# EAGLE design usb-current-meter (EAGLE 6.3)
Assembly variants: rectifier, bias
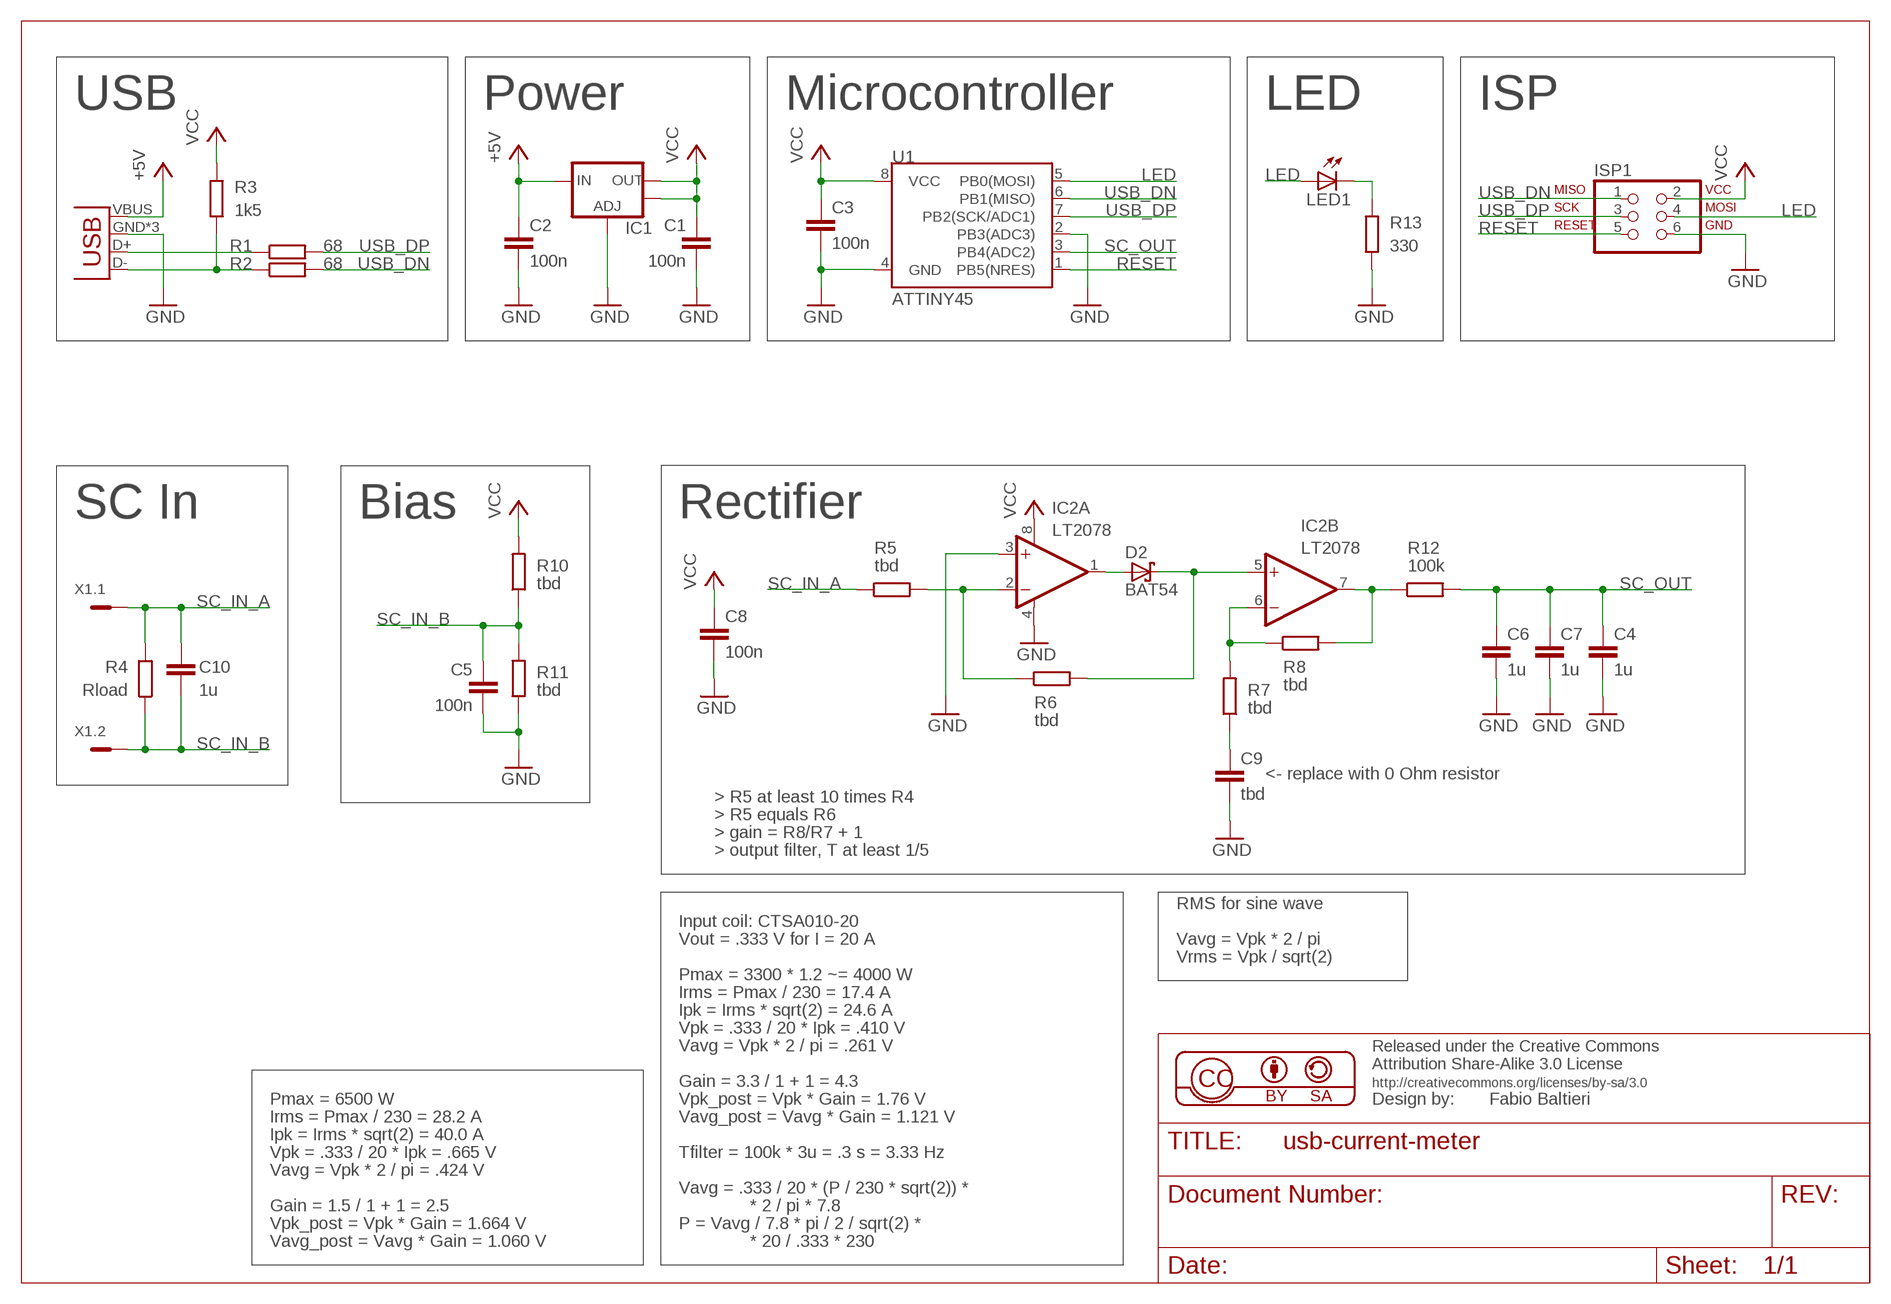
[diagram p0: schematic, sheet 1]

## Parts
C1  100n  C-EUC0805  [C0805]
C2  100n  C-EUC0805  [C0805]
C3  100n  C-EUC0805  [C0805]
C4  1u  C-EUC0805  [C0805]  (not fitted in variant bias)
C5  100n  C-EUC0805  [C0805]  (not fitted in variant rectifier)
C6  1u  C-EUC0805  [C0805]  (not fitted in variant bias)
C7  1u  C-EUC0805  [C0805]  (not fitted in variant bias)
C8  100n  C-EUC0805  [C0805]
C9  tbd  C-EUC0805  [C0805]  (variant rectifier: 0)
C10  1u  C-EUC0805  [C0805]
D2  BAT54  [SOT23]  (not fitted in variant bias)
IC1  V_REG_LM1117SOT223  [SOT223]
IC2  LT2078  OPA2234U  [SO08]  (not fitted in variant bias)
ISP1  ISP-AVR910  [2X03_BORDER_TP]
LED1  LEDSML0805  [SML0805]
R1  68  R-EU_R0603  [R0603]
R2  68  R-EU_R0603  [R0603]
R3  1k5  R-EU_R0603  [R0603]
R4  Rload  R-EU_R0805  [R0805]  (not fitted in variant rectifier)  (not fitted in variant bias)
R5  tbd  R-EU_R0603  [R0603]  (variant bias: 0)  (variant rectifier: 10k)
R6  tbd  R-EU_R0603  [R0603]  (variant bias: 0)  (variant rectifier: 10k)
R7  tbd  R-EU_R0603  [R0603]  (not fitted in variant bias)  (variant rectifier: 1k)
R8  tbd  R-EU_R0603  [R0603]  (not fitted in variant bias)  (variant rectifier: 3.3k)
R10  tbd  R-EU_R0603  [R0603]  (not fitted in variant rectifier)
R11  tbd  R-EU_R0603  [R0603]  (variant rectifier: 0)
R12  100k  R-EU_R0603  [R0603]  (variant bias: 0)
R13  330  R-EU_R0603  [R0603]
U1  ATTINY45  [SO08-EIAJ]
X1  MC2  [MC2]
X3  USB-A-H  [USB-A-H]

## Nets
+5V: C2.1 IC1.3(IN) X3.VBUS(GND)
GND: C1.2 C2.2 C3.2 C4.2 C5.2 C6.2 C7.2 C8.2 C9.2 IC1.1(ADJ) IC2.3(A:+IN) IC2.4(A:V-) ISP1.6 R11.1 R13.1 U1.2(PB3(ADC3)) U1.4(GND) X3.GND2(VBUS) X3.GND3(VBUS) X3.GND(VBUS)
LED: ISP1.4 LED1.A U1.5(PB0(MOSI))
N$1: R2.1 R3.1 X3.D-(D+)
N$2: R1.1 X3.D+(D-)
N$3: LED1.C R13.2
N$4: C9.1 R7.1
N$7: IC2.2(A:-IN) R5.2 R6.1
N$8: D2.1(A) IC2.1(A:OUT)
N$9: D2.3(C) IC2.5(B:+IN) R6.2
N$11: IC2.6(B:-IN) R7.2 R8.1
N$12: IC2.7(B:OUT) R8.2 R12.1
RESET: ISP1.5 U1.1(PB5(NRES))
SC_IN_A: C10.1 R4.2 R5.1 X1.1
SC_IN_B: C5.1 C10.2 R4.1 R10.1 R11.2 X1.2
SC_OUT: C4.1 C6.1 C7.1 R12.2 U1.3(PB4(ADC2))
USB_DN: ISP1.1 R2.2 U1.6(PB1(MISO))
USB_DP: ISP1.3 R1.2 U1.7(PB2(SCK/ADC1))
VCC: C1.1 C3.1 C8.1 IC1.2(OUT) IC1.4(OUT) IC2.8(A:V+) ISP1.2 R3.2 R10.2 U1.8(VCC)

## Notes on the sheet
- USB | Power | Microcontroller | LED | ISP
- SC In | Bias | Rectifier
- <- replace with 0 Ohm resistor
- > R5 at least 10 times R4
- > R5 equals R6
- > gain = R8/R7 + 1
- > output filter, T at least 1/5
- RMS for sine wave
- Input coil: CTSA010-20
- Vout = .333 V for I = 20 A | Vavg = Vpk * 2 / pi
- Vrms = Vpk / sqrt(2)
- Pmax = 3300 * 1.2 ~= 4000 W
- Irms = Pmax / 230 = 17.4 A
- Ipk = Irms * sqrt(2) = 24.6 A
- Vpk = .333 / 20 * Ipk = .410 V
- Vavg = Vpk * 2 / pi = .261 V
- Gain = 3.3 / 1 + 1 = 4.3
- Pmax = 6500 W | Vpk_post = Vpk * Gain = 1.76 V
- Irms = Pmax / 230 = 28.2 A | Vavg_post = Vavg * Gain = 1.121 V
- Ipk = Irms * sqrt(2) = 40.0 A
- Vpk = .333 / 20 * Ipk = .665 V | Tfilter = 100k * 3u = .3 s = 3.33 Hz
- Vavg = Vpk * 2 / pi = .424 V
- Vavg = .333 / 20 * (P / 230 * sqrt(2)) *
- Gain = 1.5 / 1 + 1 = 2.5 | * 2 / pi * 7.8
- Vpk_post = Vpk * Gain = 1.664 V | P = Vavg / 7.8 * pi / 2 / sqrt(2) *
- Vavg_post = Vavg * Gain = 1.060 V | * 20 / .333 * 230

## Library data of the parts
C1-C10 = rcl:C-EU: CAPACITOR, European symbol
D2 = diode:BAT54: Schottky Diodes Source: Fairchild .. BAT54.pdf
IC1 = SparkFun:V_REG_LM1117: Voltage Regulator LM1117 Standard adjustable voltage regulator but in SMD form. Spark Fun Electronics SKU : COM-00595
IC2 = burr-brown:OPA2234: Operational Amplifier; MF: TEXAS INSTRUMENTS; MPN: OPA2234U; OC_FARNELL: 1212441; OC_NEWARK: 96K4523
ISP1 = balto:ISP-AVR910: PIN HEADER
LED1 = led:LED: LED OSRAM: - CHIPLED LG R971, LG N971, LY N971, LG Q971, LY Q971, LO R971, LY R971 LH N974, LH R974 LS Q976, LO Q976, LY Q976 LO Q996 - Hyper CHIPLED LW Q18S LB Q993, LB Q99A, LB R99A - SideLED LS A670, LO A670, LY A670, LG A670, LP A670 LB A673, LV A673, LT A673, LW A673 LH A674 LY A675 LS A676, LA A676, LO A676, LY A676, LW A676 LS A679, LY A679, LG A679 - Hyper Micro SIDELED® LS Y876, LA Y876, LO Y876, LY Y876 LT Y87S - SmartLED LW L88C, LW L88S LB L89C, LB L89S, LG L890 LS L89K, LO L89K, LY L89K LS L896, LA L896, LO L896, LY L896 - TOPLED LS T670, LO T670, LY T670, LG T670, LP T670 LSG T670, LSP T670, LSY T670, LOP T670, LYG T670 LG T671, LOG T671, LSG T671 LB T673, LV T673, LT T673, LW T673 LH T674 LS T676, LA T676, LO T676, LY T676, LB T676, LH T676, LSB T676, LW T676 LB T67C, LV T67C, LT T67C, LS T67K, LO T67K, LY T67K, LW E67C LS E67B, LA E67B, LO E67B, LY E67B, LB E67C, LV E67C, LT E67C LW T67C LS T679, LY T679, LG T679 LS T770, LO T770, LY T770, LG T770, LP T770 LB T773, LV T773, LT T773, LW T773 LH T774 LS E675, LA E675, LY E675, LS T675 LS T776, LA T776, LO T776, LY T776, LB T776 LHGB T686 LT T68C, LB T68C - Hyper Mini TOPLED® LB M676 - Mini TOPLED Santana® LG M470 LS M47K, LO M47K, LY M47K Source: http://www.osram.convergy.de LUXEON: - LUMILED® LXK2-PW12-R00, LXK2-PW12-S00, LXK2-PW14-U00, LXK2-PW14-V00 LXK2-PM12-R00, LXK2-PM12-S00, LXK2-PM14-U00 LXK2-PE12-Q00, LXK2-PE12-R00, LXK2-PE12-S00, LXK2-PE14-T00, LXK2-PE14-U00 LXK2-PB12-K00, LXK2-PB12-L00, LXK2-PB12-M00, LXK2-PB14-N00, LXK2-PB14-P00, LXK2-PB14-Q00 LXK2-PR12-L00, LXK2-PR12-M00, LXK2-PR14-Q00, LXK2-PR14-R00 LXK2-PD12-Q00, LXK2-PD12-R00, LXK2-PD12-S00 LXK2-PH12-R00, LXK2-PH12-S00 LXK2-PL12-P00, LXK2-PL12-Q00, LXK2-PL12-R00 Source: www.luxeon.com KINGBRIGHT: KA-3528ASYC Source: www.kingbright.com
R1-R8 R10-R13 = rcl:R-EU_: RESISTOR, European symbol
U1 = SparkFun:ATTINY45: Atmel ATTiny45
X1 = con-phoenix-381_l:MC2: Mini-Combicon 3.81mm horizontal 2-polig MC 1,5/2-G-3,81 Artikel-Nr. 1803277
X3 = SparkFun:USB: USB Connectors USB-B-PTH is fully proven SKU : PRT-00139 USB-miniB is fully proven SKU : PRT-00587 USB-A-PCB is untested. USB-A-H is throughly reviewed, but untested. Spark Fun Electronics SKU : PRT-00437 USB-B-SMT is throughly reviewed, but untested. Needs silkscreen touching up. USB-A-S has not been used/tested USB-MB-H has not been used/tested

## Board
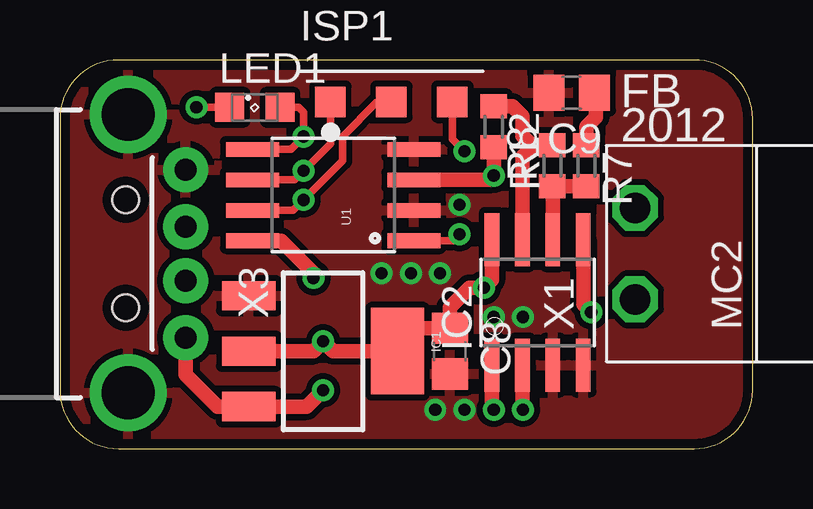
[diagram p1: board, top side]
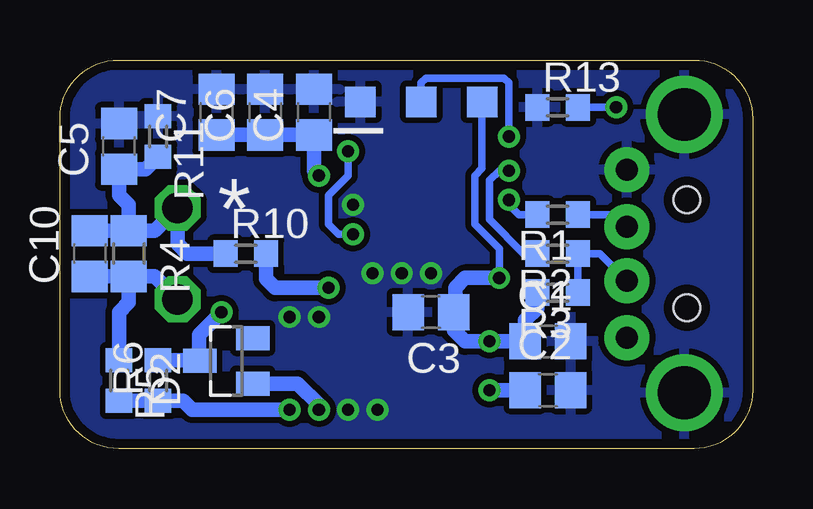
[diagram p2: board, bottom side, seen from below]

Size 28.88 x 16.2 mm. Coordinates in mm from the lower left corner, seen from the top.
Outline: 2.44,0 26.44,0 arc90 28.88,2.44 28.88,13.76 arc90 26.44,16.2 2.44,16.2 arc90 0,13.76 0,2.44 arc90 2.44,0
Copper layers (1*16): Top 0.035mm / dielectric 1.5mm / Bottom 0.035mm
Design rules "default": minimum track width 8mil, minimum drill 20mil, track to track 8mil, track to pad 8mil, pad to pad 8mil, via to via 8mil, smd to smd 8mil, copper to edge 16mil, drill to drill 8mil, minimum pad ring 8mil, minimum via ring 8mil, stop-mask expansion 4mil, vias tented up to drill 20mil, thermal gap 10mil

### Footprints (pad centres in the part's own frame; a part is rotated, then mirrored left to right if it is on the bottom)
C0805 = smd 1.3 x 1.5: 1 -0.95,0; 2 0.95,0
SOT23 = smd 1 x 1.4: 1 -0.95,-1.1; 2 0.95,-1.1; 3 0,1.1
SOT223 = smd 1.219 x 2.235: 1 -2.311,-3.099; 2 0,-3.099; 3 2.311,-3.099 | smd 3.6 x 2.2: 4 0,3.099
SO08 = smd 0.61 x 2.21: 1 -1.905,-2.616; 2 -0.635,-2.616; 3 0.635,-2.616; 4 1.905,-2.616; 5 1.905,2.616; 6 0.635,2.616; 7 -0.635,2.616; 8 -1.905,2.616
2X03_BORDER_TP = smd 1.27 x 1.27: 1 -2.54,0.635; 3 0,0.635; 5 2.54,0.635 | smd 1.27 x 1.27 bottom: 2 -2.54,0.635; 4 0,0.635; 6 2.54,0.635
SML0805 = smd 1.2 x 1.2: A 1.05,0; C -1.05,0
R0603 = smd 1 x 1.1: 1 -0.85,0; 2 0.85,0
R0805 = smd 1.3 x 1.5: 1 -0.95,0; 2 0.95,0
SO08-EIAJ = smd 0.61 x 2.21: 1 -1.905,-3.378; 2 -0.635,-3.378; 3 0.635,-3.378; 4 1.905,-3.378; 5 1.905,3.353; 6 0.635,3.353; 7 -0.635,3.353; 8 -1.905,3.353
MC2 = drill 1.27 octagon: 1 -1.905,0; 2 1.905,0
USB-A-H = drill 0.914 pad 1.88: D+ 2.4,1.127; D- 2.4,-1.127; GND 2.4,3.5; VBUS 2.4,-3.5 | drill 2.2: GND2 0,-5.8; GND3 0,5.8 | hole 1.1: -0.1,2.25; -0.1,-2.25

### Placement (x,y rotation side)
C1  8.53,4.47 0 bottom
C2  8.53,2.44 0 bottom
C3  13.41,5.69 180 bottom
C4  18.29,14.02 90 bottom
C5  26.42,12.6 90 bottom
C6  20.32,14.02 90 bottom
C7  22.35,14.02 90 bottom
C8  16.26,4.06 270 top
C9  21.34,14.83 180 top
C10  27.64,8.13 90 bottom
D2  21.95,3.66 90 bottom
IC1  10.97,4.06 270 top
IC2  19.91,6.1 0 top
ISP1  13.82,13.82 0 top
LED1  8.13,14.22 0 top
R1  8.13,9.75 180 bottom
R2  8.13,8.13 180 bottom
R3  8.13,6.5 180 bottom
R4  26.01,8.13 270 bottom
R5  26.42,2.84 270 bottom
R6  24.79,2.84 90 bottom
R7  21.95,11.79 270 top
R8  20.52,11.79 90 top
R10  21.13,8.13 0 bottom
R11  24.79,13 270 bottom
R12  18.08,13.41 270 top
R13  8.13,14.22 0 bottom
U1  11.38,10.57 90 top
X1  23.98,8.13 90 top
X3  2.84,8.13 0 top

### Tracks (layer width: path | path; a pad name or v marks a point on that pad's centre or on a via)
+5V  (via drill 0.51)
  Top 0.61: X3.VBUS 5.24,3.09 6.58,1.75 IC1.3 10.29,1.75 v10.97,2.44
  Bottom 0.61: C2.1 v10.97,2.44
GND  (via drill 0.51)
  other vias: 16.87,1.63 15.65,1.63 18.08,5.49 19.3,5.49 14.63,7.32 15.85,7.32 13.41,7.32 16.66,10.16
  pour Top (isolate 0.254): 0,16.26 29.26,16.26 28.85,0 0,0
  pour Bottom (isolate 0.254): 0,16.26 29.26,16.26 28.85,0 0,0
LED  (via drill 0.51)
  Top 0.305: LED1.A 9.96,14.22 10.16,14.02 v10.16,13.01 9.63,12.47 U1.5
  Bottom 0.305: v10.16,13.01 10.16,15.24 10.36,15.44 13.61,15.44 13.82,15.24 ISP1.4
N$1
  Bottom 0.305: R3.1 R2.1 6.37,8.13 X3.D-
N$2
  Bottom 0.305: R1.1 5.74,9.75 X3.D+
N$3  (via drill 0.51)
  Top 0.305: LED1.C v5.69,14.22
  Bottom 0.305: R13.2 v5.69,14.22
N$4
  Top 0.61: R7.1 21.95,13.41 22.35,13.82 22.35,14.77 C9.1
N$7  (via drill 0.51)
  Top 0.61: IC2.2 19.28,1.65 v19.3,1.63
  Bottom 0.61: R5.2 R6.1 23.74,2 23.37,1.63 v19.3,1.63
N$8  (via drill 0.51)
  Top 0.61: IC2.1 18.01,1.7 v18.08,1.63
  Bottom 0.61: D2.1 18.96,2.71 18.08,1.83 v18.08,1.63
N$9  (via drill 0.51)
  Top 0.61: IC2.5 21.82,6.02 v22.15,5.69
  Bottom 0.61: R6.2 23.08,3.69 | 23.08,3.69 D2.3 | 23.08,3.69 23.08,4.76 v22.15,5.69
N$11
  Top 0.61: R7.2 R8.1 20.55,10.91 IC2.6
N$12
  Top 0.61: R12.1 18.86,14.26 19.28,13.84 19.28,13.03 19.71,12.6 | 20.52,12.62 R8.2 20.49,12.6 19.71,12.6 | IC2.7 19.28,12.17 19.71,12.6
RESET  (via drill 0.51)
  Top 0.305: ISP1.5 16.36,12.9 v16.87,12.39 | U1.1 16.38,8.66 v16.66,8.94
  Bottom 0.305: v16.87,12.39 16.87,11.38 17.68,10.57 17.68,9.35 17.27,8.94 v16.66,8.94
SC_IN_A
  Bottom 0.61: R4.2 24.93,7.18 X1.1 | R5.1 26.42,5.69 26.01,6.1 R4.2 | R4.2 C10.1
SC_IN_B
  Bottom 0.61: R4.1 24.93,9.08 X1.2 23.98,8.53 23.57,8.13 R10.1 | R11.2 25.3,11.65 C5.1 26.42,10.57 26.01,10.16 R4.1 | R4.1 C10.2
SC_OUT  (via drill 0.51)
  Top 0.61: R12.2 v18.08,11.38 17.91,11.2 U1.3
  Bottom 0.61: v18.08,11.38 18.29,11.58 C4.1 C6.1 C7.1
USB_DN  (via drill 0.51)
  Top 0.305: U1.6 9.78,11.2 v10.16,11.58 11.28,12.7 ISP1.1
  Bottom 0.305: R2.2 9.55,8.13 10.97,9.55 10.97,11.18 10.57,11.58 v10.16,11.58
USB_DP  (via drill 0.51)
  Top 0.305: U1.7 9.73,9.93 v10.16,10.36 11.79,11.99 11.79,13.01 13.21,14.43 13.82,14.43 ISP1.3
  Bottom 0.305: R1.2 9.75,9.75 10.16,10.16 v10.16,10.36
VCC  (via drill 0.51)
  Top 0.61: IC1.2 10.57,4.06 v10.97,4.47 11.38,4.06 IC1.4 15.02,5.01 C8.1 16.26,5.89 17.07,6.71 v17.68,6.71 18.01,7.04 IC2.8 | U1.8 9.22,8.66 10.57,7.32 v10.57,7.11
  Bottom 0.305: ISP1.2 11.28,11.68 11.58,11.38 11.58,9.35 10.57,8.33 v10.57,7.11
  Bottom 0.61: R3.2 8.98,5.86 9.48,5.35 C1.1 v10.97,4.47 11.99,4.47 12.46,4.94 C3.1 12.4,5.76 12.4,6.71 11.99,7.11 v10.57,7.11 | v17.68,6.71 19.91,6.71 20.28,7.08 R10.2

### Text on the board
_tsilk: FB | 2012
_bsilk: _ | *